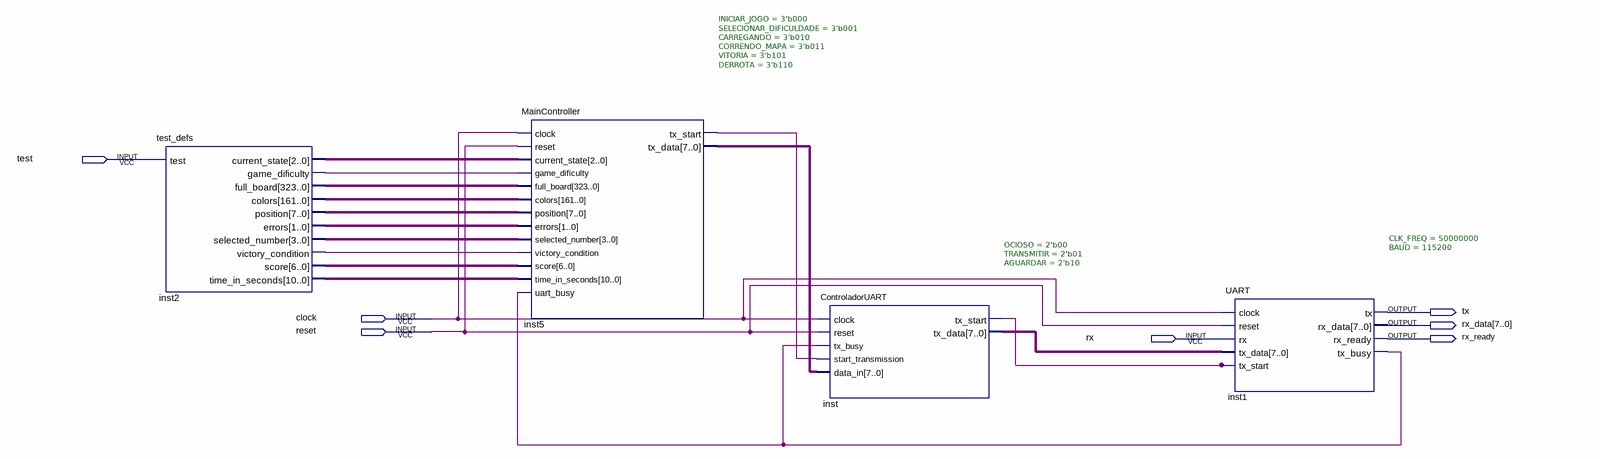
[diagram p0: schematic sheet]
// Quartus schematic UART_Memoria.bdf as structural Verilog: 4 symbols, 7 pins
module UART_Memoria (
  input  test,
  input  clock,
  input  reset,
  input  rx,
  output tx,
  output [7:0] rx_data,
  output rx_ready
);

  wire inst1_tx_busy, inst2_game_dificulty, inst2_victory_condition, inst5_tx_start, inst_tx_start;
  wire [1:0] inst2_errors;
  wire [2:0] inst2_current_state;
  wire [3:0] inst2_selected_number;
  wire [6:0] inst2_score;
  wire [7:0] inst2_position, inst5_tx_data, inst_tx_data;
  wire [10:0] inst2_time_in_seconds;
  wire [161:0] inst2_colors;
  wire [323:0] inst2_full_board;

  test_defs inst2 (
    .test(test), .current_state(inst2_current_state), .game_dificulty(inst2_game_dificulty),
    .full_board(inst2_full_board), .colors(inst2_colors), .position(inst2_position), .errors(inst2_errors),
    .selected_number(inst2_selected_number), .victory_condition(inst2_victory_condition),
    .score(inst2_score), .time_in_seconds(inst2_time_in_seconds));
  MainController #(.INICIAR_JOGO(3'b000), .SELECIONAR_DIFICULDADE(3'b001), .CARREGANDO(3'b010), .CORRENDO_MAPA(3'b011), .VITORIA(3'b101), .DERROTA(3'b110)) inst5 (
    .clock(clock), .reset(reset), .current_state(inst2_current_state), .game_dificulty(inst2_game_dificulty),
    .full_board(inst2_full_board), .colors(inst2_colors), .position(inst2_position), .errors(inst2_errors),
    .selected_number(inst2_selected_number), .victory_condition(inst2_victory_condition),
    .score(inst2_score), .time_in_seconds(inst2_time_in_seconds), .uart_busy(inst1_tx_busy),
    .tx_start(inst5_tx_start), .tx_data(inst5_tx_data));
  ControladorUART #(.OCIOSO(2'b00), .TRANSMITIR(2'b01), .AGUARDAR(2'b10)) inst (
    .clock(clock), .reset(reset), .tx_busy(inst1_tx_busy), .start_transmission(inst5_tx_start),
    .data_in(inst5_tx_data), .tx_start(inst_tx_start), .tx_data(inst_tx_data));
  UART #(.CLK_FREQ(50000000), .BAUD(115200)) inst1 (
    .clock(clock), .reset(reset), .rx(rx), .tx_data(inst_tx_data), .tx_start(inst_tx_start), .tx(tx),
    .rx_data(rx_data), .rx_ready(rx_ready), .tx_busy(inst1_tx_busy));
endmodule
